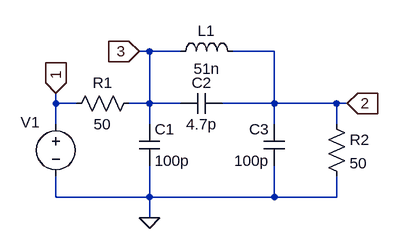
[diagram p0: schematic SMNA_demo_sch.asc]
SMNA_demo_sch.asc, the LTspice schematic file:
Version 4
SHEET 1 880 680
WIRE 112 -48 96 -48
WIRE 160 -48 112 -48
WIRE 304 -48 240 -48
WIRE -32 32 -32 16
WIRE 0 32 -32 32
WIRE 112 32 112 -48
WIRE 112 32 80 32
WIRE 160 32 112 32
WIRE 304 32 304 -48
WIRE 304 32 224 32
WIRE 400 32 304 32
WIRE 416 32 400 32
WIRE -32 64 -32 32
WIRE 112 64 112 32
WIRE 304 64 304 32
WIRE 400 64 400 32
WIRE -32 176 -32 144
WIRE 112 176 112 128
WIRE 112 176 -32 176
WIRE 304 176 304 128
WIRE 304 176 112 176
WIRE 400 176 400 144
WIRE 400 176 304 176
WIRE 112 208 112 176
FLAG -32 16 1
IOPIN -32 16 In
FLAG 416 32 2
IOPIN 416 32 In
FLAG 96 -48 3
IOPIN 96 -48 In
FLAG 112 208 0
SYMBOL voltage -32 48 R0
WINDOW 0 -54 13 Left 2
WINDOW 3 -54 41 Invisible 2
WINDOW 39 0 0 Left 0
SYMATTR InstName V1
SYMATTR Value 1
SYMBOL res 96 16 R90
WINDOW 0 0 56 VBottom 2
WINDOW 3 32 56 VTop 2
SYMATTR InstName R1
SYMATTR Value 50
SYMBOL res 384 48 R0
SYMATTR InstName R2
SYMATTR Value 50
SYMBOL cap 96 64 R0
SYMATTR InstName C1
SYMATTR Value 100p
SYMBOL cap 224 16 R90
WINDOW 0 0 32 VBottom 2
WINDOW 3 32 32 VTop 2
SYMATTR InstName C2
SYMATTR Value 4.7p
SYMBOL cap 320 128 R180
WINDOW 0 24 56 Left 2
WINDOW 3 24 8 Left 2
SYMATTR InstName C3
SYMATTR Value 100p
SYMBOL ind 144 -32 R270
WINDOW 0 32 56 VTop 2
WINDOW 3 5 56 VBottom 2
SYMATTR InstName L1
SYMATTR Value 51n

The netlist it stands for:
* SMNA_demo_sch.asc
V1 1 0 1
R1 3 1 50
R2 2 0 50
C1 3 0 100p
C2 2 3 4.7p
C3 0 2 100p
L1 3 2 51n
.backanno
.end